# EAGLE schematic PCR_Main_ckt (EAGLE 9.6.2)

## Sheet 1 of 2
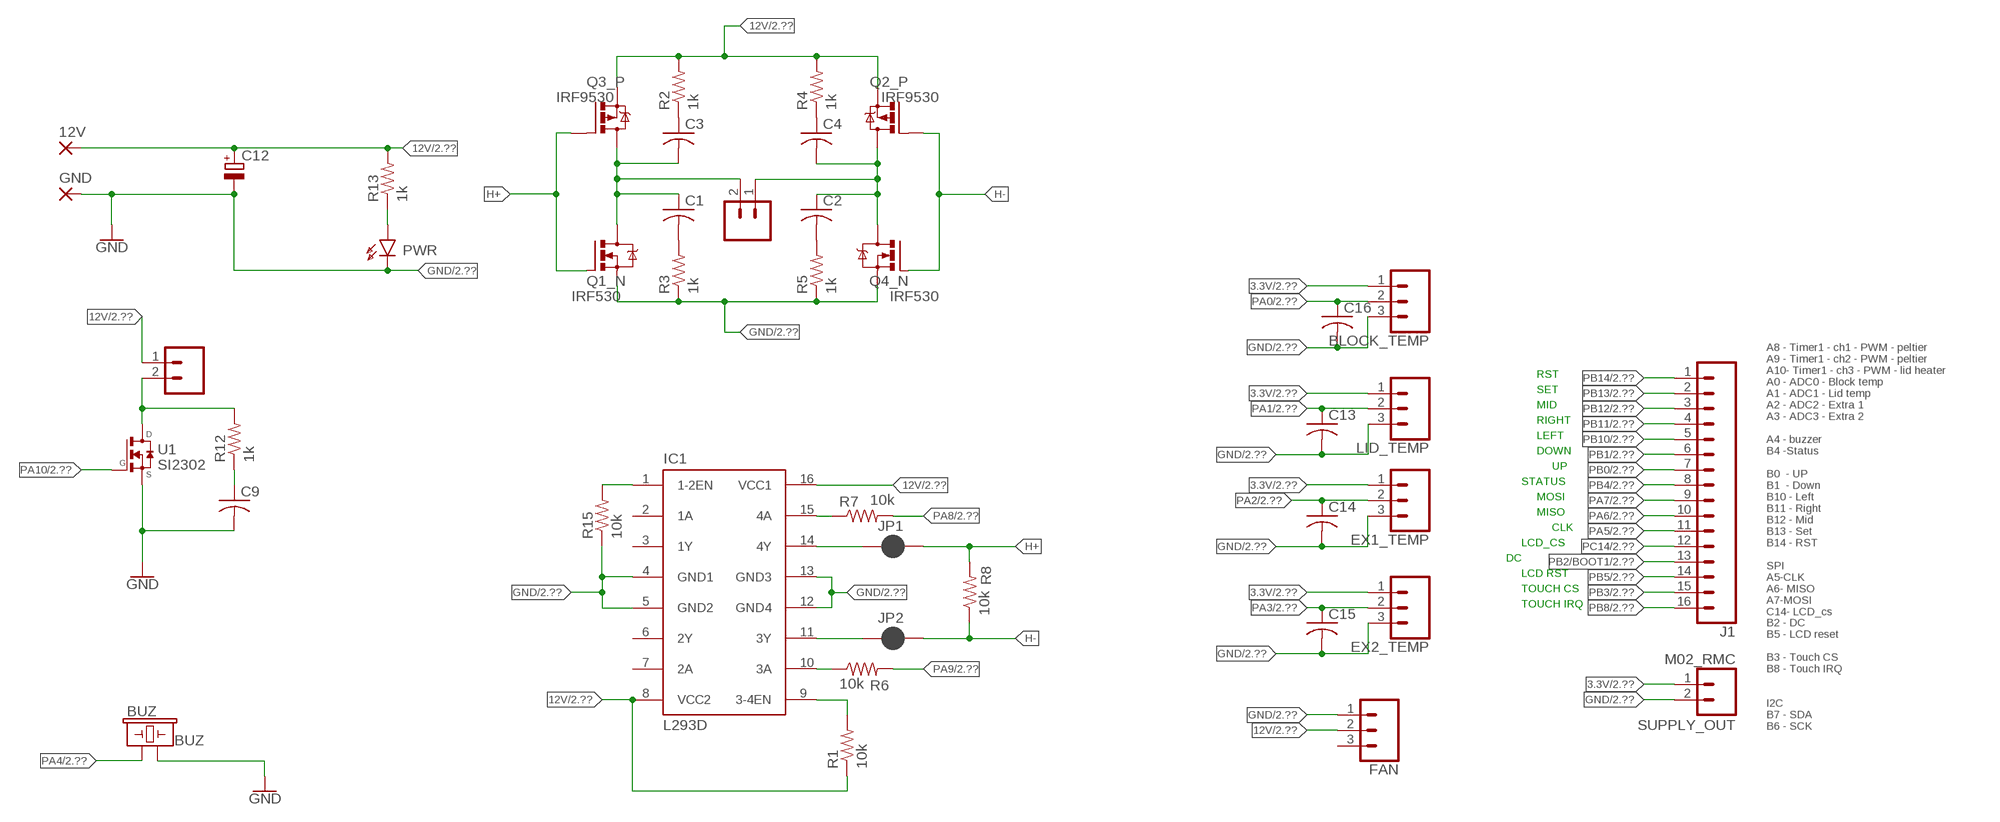
[diagram p0: schematic, sheet 1]

### Parts
12V  WIREPAD4,16O1,6  [4,16O1,6]
+PELTIER-  SCREW_TERMINAL_5.08  [SCREW_TERMINAL_5.08]
BLOCK_TEMP  CONN_03  [1X03]
BUZ  BUZ  BUZZER-PTH  [BUZZER-12MM]
C1  C-USC0805  [C0805]
C2  C-USC0805  [C0805]
C3  C-USC0805  [C0805]
C4  C-USC0805  [C0805]
C9  C-USC0805  [C0805]
C12  CPOL-EUE5-5  [E5-5]
C13  C-USC0805  [C0805]
C14  C-USC0805  [C0805]
C15  C-USC0805  [C0805]
C16  C-USC0805  [C0805]
EX1_TEMP  CONN_03  [1X03]
EX2_TEMP  CONN_03  [1X03]
FAN  CONN_03  [1X03]
GND  WIREPAD4,16O1,6  [4,16O1,6]
IC1  L293D  [DIL16]
J1  CONN_16  [1X16]
JP1  JUMPER-SMT_2_NC_PASTE_SILK  [SMT-JUMPER_2_NC_PASTE_SILK]
JP2  JUMPER-SMT_2_NC_PASTE_SILK  [SMT-JUMPER_2_NC_PASTE_SILK]
LID_HEATER  SCREW_TERMINAL_5.08  [SCREW_TERMINAL_5.08]
LID_TEMP  CONN_03  [1X03]
PWR  LED_RED_0805  [RED_LED]
Q1_N  IRF530  [TO220BV]
Q2_P  IRF9530  [TO220BV]
Q3_P  IRF9530  [TO220BV]
Q4_N  IRF530  [TO220BV]
R1  10k  R-US_R0805  [R0805]
R2  1k  R-US_R0805  [R0805]
R3  1k  R-US_R0805  [R0805]
R4  1k  R-US_R0805  [R0805]
R5  1k  R-US_R0805  [R0805]
R6  10k  R-US_R0805  [R0805]
R7  10k  R-US_R0805  [R0805]
R8  10k  R-US_R0805  [R0805]
R12  1k  R-US_R0805  [R0805]
R13  1k  R-US_R0805  [R0805]
R15  10k  R-US_R0805  [R0805]
SUPPLY_OUT  M02_RMC  [M02_RMC]
U1  SI2302  [SOT95P240X110-3N]

### Nets
3.3V: BLOCK_TEMP.1 EX1_TEMP.1 EX2_TEMP.1 LID_TEMP.1 SUPPLY_OUT.1 ; also sheet 2
12V: 12V.1(P) C12.+ FAN.2 IC1.8(VCC2) IC1.16(VCC1) LID_HEATER.1 Q2_P.S Q3_P.S R1.1 R2.2 R4.2 R13.2 ; also sheet 2
GND: BLOCK_TEMP.3 BUZ.- C9.2 C12.- C13.2 C14.2 C15.2 C16.2 EX1_TEMP.3 EX2_TEMP.3 FAN.1 GND.1(P) IC1.4(GND1) IC1.5(GND2) IC1.12(GND4) IC1.13(GND3) LID_TEMP.3 PWR.2(C) Q1_N.S Q4_N.S R3.1 R5.1 R15.1 SUPPLY_OUT.2 U1.2(S) ; also sheet 2
H+: JP1.2 Q1_N.G Q3_P.G R8.2
H-: JP2.2 Q2_P.G Q4_N.G R8.1
N$1: IC1.10(3A) R6.1
N$2: +PELTIER-.2 C1.1 C3.2 Q1_N.D Q3_P.D
N$3: +PELTIER-.1 C2.1 C4.2 Q2_P.D Q4_N.D
N$4: IC1.15(4A) R7.1
N$5: PWR.1(A) R13.1
N$6: IC1.14(4Y) JP1.1
N$7: IC1.9(3-4EN) R1.2
N$8: IC1.11(3Y) JP2.1
N$9: C1.2 R3.2
N$10: C2.2 R5.2
N$11: C3.1 R2.1
N$12: C4.1 R4.1
N$13: LID_HEATER.2 R12.2 U1.3(D)
N$20: C9.1 R12.1
N$22: IC1.1(1-2EN) R15.2
PA0: BLOCK_TEMP.2 C16.1 ; also sheet 2
PA1: C13.1 LID_TEMP.2 ; also sheet 2
PA2: C14.1 EX1_TEMP.2 ; also sheet 2
PA3: C15.1 EX2_TEMP.2 ; also sheet 2
PA4: BUZ.+ ; also sheet 2
PA5: J1.11 ; also sheet 2
PA6: J1.10 ; also sheet 2
PA7: J1.9 ; also sheet 2
PA8: R7.2 ; also sheet 2
PA9: R6.2 ; also sheet 2
PA10: U1.1(G) ; also sheet 2
PB0: J1.7 ; also sheet 2
PB1: J1.6 ; also sheet 2
PB2/BOOT1: J1.13 ; also sheet 2
PB3: J1.15 ; also sheet 2
PB4: J1.8 ; also sheet 2
PB5: J1.14 ; also sheet 2
PB8: J1.16 ; also sheet 2
PB10: J1.5 ; also sheet 2
PB11: J1.4 ; also sheet 2
PB12: J1.3 ; also sheet 2
PB13: J1.2 ; also sheet 2
PB14: J1.1 ; also sheet 2
PC14: J1.12 ; also sheet 2
Unconnected: FAN.3 IC1.2(1A) IC1.3(1Y) IC1.6(2Y) IC1.7(2A)

### Notes on the sheet
- RST
- SET
- MID
- RIGHT
- LEFT
- DOWN
- UP
- STATUS
- MOSI
- MISO
- CLK
- LCD_CS
- DC
- LCD RST
- TOUCH CS
- TOUCH IRQ
- A8 - Timer1 - ch1 - PWM - peltier
  A9 - Timer1 - ch2 - PWM - peltier
  A10- Timer1 - ch3 - PWM - lid heater
  A0 - ADC0 - Block temp
  A1 - ADC1 - Lid temp
  A2 - ADC2 - Extra 1
  A3 - ADC3 - Extra 2
  
  A4 - buzzer
  B4 -Status
  
  B0  - UP
  B1  - Down
  B10 - Left
  B11 - Right
  B12 - Mid
  B13 - Set
  B14 - RST
  
  SPI
  A5-CLK
  A6- MISO
  A7-MOSI
  C14- LCD_cs
  B2 - DC
  B5 - LCD reset
  
  B3 - Touch CS
  B8 - Touch IRQ
  
  
  I2C
  B7 - SDA
  B6 - SCK

## Sheet 2 of 2: STM32F103
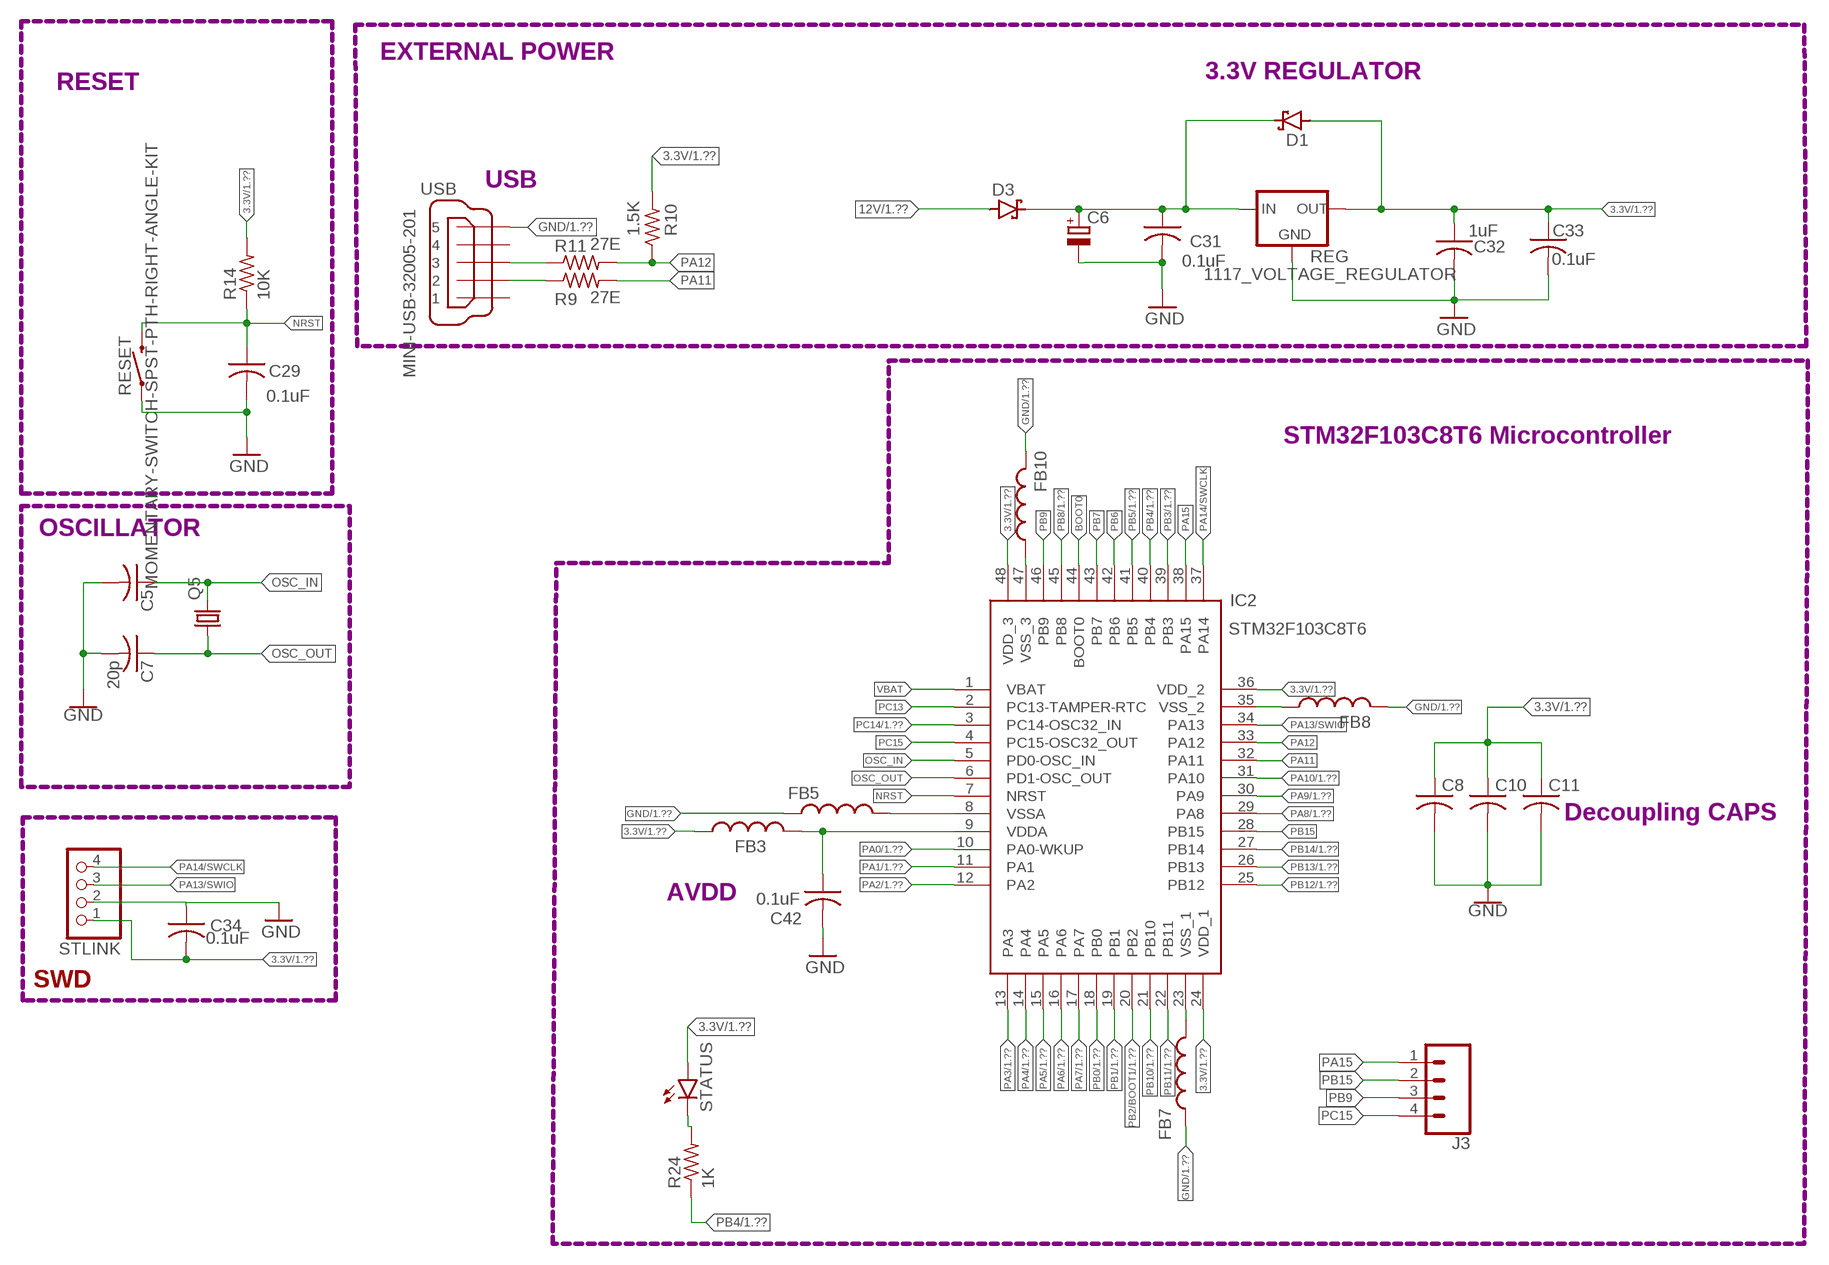
[diagram p1: schematic, sheet 2]

### Parts
C5  C-USC0805  [C0805]
C6  CPOL-EUE5-5  [E5-5]
C7  20p  C-USC0805  [C0805]
C8  C-USC0805  [C0805]
C10  C-USC0805  [C0805]
C11  C-USC0805  [C0805]
C29  0.1uF  C-USC0603  [C0603]
C31  0.1uF  C-USC0603  [C0603]
C32  1uF  C-USC0603  [C0603]
C33  0.1uF  C-USC0603  [C0603]
C34  0.1uF  C-USC0603  [C0603]
C42  0.1uF  C-USC0603  [C0603]
D1  SCHOTTKY-DIODESMD  [SMB]
D3  SCHOTTKY-DIODESMD  [SMB]
FB3  FERRITE-BEADA  [0603]
FB5  FERRITE-BEADA  [0603]
FB7  FERRITE-BEADA  [0603]
FB8  FERRITE-BEADA  [0603]
FB10  FERRITE-BEADA  [0603]
IC2  STM32F103C8T6  [QFP50P900X900X160-48N]
J3  F04_LOCKLOCK  [F04_LOCK]
Q5  CRYSTALHC49S  [HC49/S]
R9  27E  R-US_R0805  [R0805]
R10  1.5K  R-US_R0805  [R0805]
R11  27E  R-US_R0805  [R0805]
R14  10K  R-US_R0603  [R0603]
R24  1K  R-US_R0603  [R0603]
REG  1117_VOLTAGE_REGULATOR  [SOT230P700X180-4N]
RESET  MOMENTARY-SWITCH-SPST-PTH-RIGHT-ANGLE-KIT  [TACTILE_SWITCH_PTH_RIGHT_ANGLE_KIT]
STATUS  LEDCHIP-LED0603  [CHIP-LED0603]
STLINK  PINHD-1X4  [1X04]
USB  MINI-USB-32005-201  [32005-201]

### Nets
3.3V: C8.1 C10.1 C11.1 C32.1 C33.1 C34.2 D1.A FB3.1 IC2.24(VDD_1) IC2.36(VDD_2) IC2.48(VDD_3) R10.2 R14.2 REG.2(OUT) REG.4(OUT) STATUS.A STLINK.1 ; also sheet 1
12V: D3.A ; also sheet 1
BOOT0: IC2.44(BOOT0)
GND: C5.2 C6.- C7.2 C8.2 C10.2 C11.2 C29.2 C31.2 C32.2 C33.2 C34.1 C42.2 FB5.1 FB7.1 FB8.2 FB10.2 REG.1(GND) RESET.1 STLINK.2 USB.5 ; also sheet 1
N$14: R11.1 USB.3
N$15: R9.1 USB.2
N$16: C6.+ C31.1 D1.C D3.C REG.3(IN)
N$17: FB8.1 IC2.35(VSS_2)
N$18: FB7.2 IC2.23(VSS_1)
N$19: FB10.1 IC2.47(VSS_3)
N$21: FB5.2 IC2.8(VSSA)
N$25: C42.1 FB3.2 IC2.9(VDDA)
N$33: R24.2 STATUS.C
NRST: C29.1 IC2.7(NRST) R14.1 RESET.2
OSC_IN: C5.1 IC2.5(PD0-OSC_IN) Q5.2
OSC_OUT: C7.1 IC2.6(PD1-OSC_OUT) Q5.1
PA0: IC2.10(PA0-WKUP) ; also sheet 1
PA1: IC2.11(PA1) ; also sheet 1
PA2: IC2.12(PA2) ; also sheet 1
PA3: IC2.13(PA3) ; also sheet 1
PA4: IC2.14(PA4) ; also sheet 1
PA5: IC2.15(PA5) ; also sheet 1
PA6: IC2.16(PA6) ; also sheet 1
PA7: IC2.17(PA7) ; also sheet 1
PA8: IC2.29(PA8) ; also sheet 1
PA9: IC2.30(PA9) ; also sheet 1
PA10: IC2.31(PA10) ; also sheet 1
PA11: IC2.32(PA11) R9.2
PA12: IC2.33(PA12) R10.1 R11.2
PA13/SWIO: IC2.34(PA13) STLINK.3
PA14/SWCLK: IC2.37(PA14) STLINK.4
PA15: IC2.38(PA15) J3.1
PB0: IC2.18(PB0) ; also sheet 1
PB1: IC2.19(PB1) ; also sheet 1
PB2/BOOT1: IC2.20(PB2) ; also sheet 1
PB3: IC2.39(PB3) ; also sheet 1
PB4: IC2.40(PB4) R24.1 ; also sheet 1
PB5: IC2.41(PB5) ; also sheet 1
PB6: IC2.42(PB6)
PB7: IC2.43(PB7)
PB8: IC2.45(PB8) ; also sheet 1
PB9: IC2.46(PB9) J3.3
PB10: IC2.21(PB10) ; also sheet 1
PB11: IC2.22(PB11) ; also sheet 1
PB12: IC2.25(PB12) ; also sheet 1
PB13: IC2.26(PB13) ; also sheet 1
PB14: IC2.27(PB14) ; also sheet 1
PB15: IC2.28(PB15) J3.2
PC13: IC2.2(PC13-TAMPER-RTC)
PC14: IC2.3(PC14-OSC32_IN) ; also sheet 1
PC15: IC2.4(PC15-OSC32_OUT) J3.4
VBAT: IC2.1(VBAT)
Unconnected: USB.1 USB.4

### Notes on the sheet
- EXTERNAL POWER
- 3.3V REGULATOR
- RESET
- USB
- STM32F103C8T6 Microcontroller
- OSCILLATOR
- Decoupling CAPS
- AVDD
- SWD

## Library data of the parts
12V GND = wirepad:WIREPAD: Wire PAD connect wire on PCB
+PELTIER- LID_HEATER = my_3D_components:SCREW_TERMINAL_5.08
BLOCK_TEMP EX1_TEMP EX2_TEMP FAN LID_TEMP = SparkFun-Connectors:CONN_03: Multi connection point. Often used as Generic Header-pin footprint for 0.1 inch spaced/style header connections On any of the 0.1 inch spaced packages, you can populate with these: Break Away Headers - Straight <https://www.sparkfun.com/products/116> (PRT-00116) Break Away Male Headers - Right Angle <https://www.sparkfun.com/products/553> (PRT-00553) Female Headers <https://www.sparkfun.com/products/115> (PRT-00115) Break Away Headers - Machine Pin <https://www.sparkfun.com/products/117> (PRT-00117) Break Away Female Headers - Swiss Machine Pin <https://www.sparkfun.com/products/743> (PRT-00743) Stackable Header - 3 Pin (Female, 0.1") <https://www.sparkfun.com/products/13875> (PRT-13875) For SCREWTERMINALS and SPRING TERMINALS visit here: Screw Terimnals on SparkFun.com <https://www.sparkfun.com/search/results?term=Screw+Terminals> (5mm/3.5mm/2.54mm spacing) This device is also useful as a general connection point to wire up your design to another part of your project. Our various solder wires solder well into these plated through hole pads. Hook-Up Wire - Assortment (Stranded, 22 AWG) <https://www.sparkfun.com/products/11375> (PRT-11375) Hook-Up Wire - Assortment (Solid Core, 22 AWG) <https://www.sparkfun.com/products/11367> (PRT-11367) View the entire wire category on our website here <https://www.sparkfun.com/categories/141> Special notes: Molex polarized connector foot print use with SKU : PRT-08232 with associated crimp pins and housings.
BUZ = SparkFun-Electromechanical:BUZZER: Buzzer Small round buzzers that operate around the audible 2kHz range. You can use these as speakers to create simple music or user interfaces. Variant Overview: PTH - Mini Speaker - PC Mount 12mm 2.048kHz <https://www.sparkfun.com/products/7950> PTH_KIT - Mini Speaker - PC Mount 12mm 2.048kHz <https://www.sparkfun.com/products/7950> KIT simplifies soldering by adding stop mask to one side of the pads. PTH_NO_SILK - Mini Speaker - PC Mount 12mm 2.048kHz <https://www.sparkfun.com/products/7950> No silkscreen indicator of buzzer outline. PTH_KIT_NO_SILK - Mini Speaker - PC Mount 12mm 2.048kHz <https://www.sparkfun.com/products/7950> KIT package w/o silkscreen SMD - Buzzer Audio Magnetic (CCV-084B16) SMD buzzer used on, e.g. the LilyPad Buzzer <https://www.sparkfun.com/products/8463> and RFID USB Reader <https://www.sparkfun.com/products/9963>. SMD_KIT - Buzzer Audio Magnetic (CCV-084B16) SMD Buzzer with elongated pins to make soldering easier. Used on the SparkFun Simon Says - Surface Mount Soldering Kit <https://www.sparkfun.com/products/10935>.; PROD_ID: COMP-08253; SF_SKU: COM-07950
C1-C5 C7-C11 C13-C16 = my_3D_components:C-US: CAPACITOR, American symbol
C6 C12 = rcl:CPOL-EU: POLARIZED CAPACITOR, European symbol; SPICEPREFIX: C
C29 C31 C33 C34 C42 = rcl:C-US: CAPACITOR, American symbol; SPICEPREFIX: C
C32 = my_3D_components:C-US: CAPACITOR, American symbol; SPICEPREFIX: C
D1 D3 = diode:SCHOTTKY-DIODE: Schottky Diode
FB3 FB5 FB7 FB8 FB10 = m-pad-2.1:FERRITE-BEAD: Ferrite beads in various packages
IC1 = st-microelectronics:L293D: PUSH-PULL 4 CHANNEL DRIVER; MPN: L293D; OC_FARNELL: 9589619; OC_NEWARK: 56P8249
IC2 = SamacSys_Parts:STM32F103C8T6: Mainstream Performance line, ARM Cortex-M3 MCU with 64 Kbytes Flash, 72 MHz CPU, motor control, USB and CAN Source: Datasheet <https://www.st.com/resource/en/datasheet/stm32f103c8.pdf>; ARROW_PART_NUMBER: STM32F103C8T6; ARROW_PRICE-STOCK: https://www.arrow.com/en/products/stm32f103c8t6/stmicroelectronics; DESCRIPTION: Mainstream Performance line, ARM Cortex-M3 MCU with 64 Kbytes Flash, 72 MHz CPU, motor control, USB and CAN; HEIGHT: 1.6mm; MANUFACTURER_NAME: STMicroelectronics; MANUFACTURER_PART_NUMBER: stm32f103c8t6; MOUSER_PART_NUMBER: 511-STM32F103C8T6; MOUSER_PRICE-STOCK: https://www.mouser.co.uk/ProductDetail/STMicroelectronics/STM32F103C8T6?qs=bhCVus9SdFtq6kqxsU5%2FDA%3D%3D
J1 = SparkFun-Connectors:CONN_16: Multi connection point. Often used as Generic Header-pin footprint for 0.1 inch spaced/style header connections On any of the 0.1 inch spaced packages, you can populate with these: Break Away Headers - Straight <https://www.sparkfun.com/products/116> (PRT-00116) Break Away Male Headers - Right Angle <https://www.sparkfun.com/products/553> (PRT-00553) Female Headers <https://www.sparkfun.com/products/115> (PRT-00115) Break Away Headers - Machine Pin <https://www.sparkfun.com/products/117> (PRT-00117) Break Away Female Headers - Swiss Machine Pin <https://www.sparkfun.com/products/743> (PRT-00743) For SCREWTERMINALS and SPRING TERMINALS visit here: Screw Terimnals on SparkFun.com <https://www.sparkfun.com/search/results?term=Screw+Terminals> (5mm/3.5mm/2.54mm spacing) This device is also useful as a general connection point to wire up your design to another part of your project. Our various solder wires solder well into these plated through hole pads. Hook-Up Wire - Assortment (Stranded, 22 AWG) <https://www.sparkfun.com/products/11375> (PRT-11375) Hook-Up Wire - Assortment (Solid Core, 22 AWG) <https://www.sparkfun.com/products/11367> (PRT-11367) View the entire wire category on our website here <https://www.sparkfun.com/categories/141> Special notes: Molex polarized connector foot print use with SKU : PRT-08231 with associated crimp pins and housings. 1MM SMD Version SKU: PRT-10208 NOTES ON THE VARIANTS LOCK and LOCK_LONGPADS... This footprint was designed to help hold the alignment of a through-hole component (i.e. 6-pin header) while soldering it into place. You may notice that each hole has been shifted either up or down by 0.005 of an inch from it's more standard position (which is a perfectly straight line). This slight alteration caused the pins (the squares in the middle) to touch the edges of the holes. Because they are alternating, it causes a "brace" to hold the component in place. 0.005 has proven to be the perfect amount of "off-center" position when using our standard breakaway headers. Although looks a little odd when you look at the bare footprint, once you have a header in there, the alteration is very hard to notice. Also,if you push a header all the way into place, it is covered up entirely on the bottom side.
J3 = my_3D_components:F04_LOCK: Multi connection point. Often used as Generic Header-pin footprint for 0.1 inch spaced/style header connections On any of the 0.1 inch spaced packages, you can populate with these: Break Away Headers - Straight <https://www.sparkfun.com/products/116> (PRT-00116) Break Away Male Headers - Right Angle <https://www.sparkfun.com/products/553> (PRT-00553) Female Headers <https://www.sparkfun.com/products/115> (PRT-00115) Break Away Headers - Machine Pin <https://www.sparkfun.com/products/117> (PRT-00117) Break Away Female Headers - Swiss Machine Pin <https://www.sparkfun.com/products/743> (PRT-00743) For SCREWTERMINALS and SPRING TERMINALS visit here: Screw Terimnals on SparkFun.com <https://www.sparkfun.com/search/results?term=Screw+Terminals> (5mm/3.5mm/2.54mm spacing) This device is also useful as a general connection point to wire up your design to another part of your project. Our various solder wires solder well into these plated through hole pads. Hook-Up Wire - Assortment (Stranded, 22 AWG) <https://www.sparkfun.com/products/11375> (PRT-11375) Hook-Up Wire - Assortment (Solid Core, 22 AWG) <https://www.sparkfun.com/products/11367> (PRT-11367) View the entire wire category on our website here <https://www.sparkfun.com/categories/141> Special notes: Molex polarized connector foot print use with SKU : PRT-08231 with associated crimp pins and housings. 1MM SMD Version SKU: PRT-10208; PROD_ID: CONN-09696
JP1 JP2 = SparkFun-Jumpers:JUMPER-SMT_2_NC_PASTE: Normally closed solder jumper This jumper has an aperture in the stencil to allow solder paste to bridge the split in the wire so it's normally closed (NC). Wick off the solder to open the connection. Reapply solder to reclose the connection.
PWR = my_3D_components:LED_
Q1_N Q4_N = transistor-power:IRF530: HEXFET Power MOSFET
Q2_P Q3_P = transistor-power:IRF9530: P-CHANNEL HEXFET POWER-MOS-FET Source: http://www.irf.com/product-info/datasheets/data/irf9530.pdf
Q5 = crystal:CRYSTAL: CRYSTAL; OC_FARNELL: 1667008; OC_NEWARK: unknown
R1-R13 R15 = my_3D_components:R-US_: RESISTOR, American symbol; SPICEPREFIX: R
R14 R24 = rcl:R-US_: RESISTOR, American symbol; SPICEPREFIX: R
REG = my_3D_components:1117_VOLTAGE_REGULATOR
RESET = SparkFun-Switches:MOMENTARY-SWITCH-SPST: Momentary Switch (Pushbutton) - SPST Normally-open (NO) SPST momentary switches (buttons, pushbuttons). Variants PTH-12MM - 12mm square, through-hole Momentary Pushbutton Switch - 12mm Square <https://www.sparkfun.com/products/9190> (COM-09190) PTH-6.0MM, PTH-6.0MM-KIT - 6.0mm square, through-hole Mini Pushbutton Switch <https://www.sparkfun.com/products/97> (COM-00097) KIT package intended for soldering kit's - only one side of pads' copper is exposed. PTH-RIGHT-ANGLE-KIT - Right-angle, through-hole Right Angle Tactile Button <https://www.sparkfun.com/products/10791> - Used on SparkFun BigTime Watch Kit <https://www.sparkfun.com/products/11734> SMD-12MM - 12mm square, surface-mount Tactile Button - SMD (12mm) <https://www.sparkfun.com/products/12993> (COM-12993) Used on SparkFun PicoBoard <https://www.sparkfun.com/products/11888> SMD-4.5MM - 4.5mm Square Trackball Switch Used on SparkFun Blackberry Trackballer Breakout <https://www.sparkfun.com/products/13169> SMD-4.6MMX2.8MM - 4.60mm x 2.80mm, surface mount Used on SparkFun SAMD21 Mini Breakout <https://www.sparkfun.com/products/13664> SMD-5.2MM, SMD-5.2-REDUNDANT - 5.2mm square, surface-mount Mini Pushbutton Switch - SMD <https://www.sparkfun.com/products/8720> (COM-08720) Used on Arduino Pro Mini <https://www.sparkfun.com/products/11114> REDUNDANT package connects both switch circuits together SMD-6.0X3.5MM - 6.0 x 3.5mm, surface mount Momentary Reset Switch SMD <https://www.sparkfun.com/products/8229> (COM-08229) SMD-6.2MM-TALL - 6.2mm square, surface mount Tactile Button - SMD (6mm) <https://www.sparkfun.com/products/12992> Used on SparkFun Digital Sandbox <https://www.sparkfun.com/products/12651> SMD-RIGHT-ANGLE - Right-angle, surface mount Used on SparkFun Block for Intel® Edison - Arduino <https://www.sparkfun.com/products/13036>; PROD_ID: CONN-10672; SF_SKU: COM-10791
STATUS = led:LED: LED OSRAM: - CHIPLED LG R971, LG N971, LY N971, LG Q971, LY Q971, LO R971, LY R971 LH N974, LH R974 LS Q976, LO Q976, LY Q976 LO Q996 - Hyper CHIPLED LW Q18S LB Q993, LB Q99A, LB R99A - SideLED LS A670, LO A670, LY A670, LG A670, LP A670 LB A673, LV A673, LT A673, LW A673 LH A674 LY A675 LS A676, LA A676, LO A676, LY A676, LW A676 LS A679, LY A679, LG A679 - Hyper Micro SIDELED® LS Y876, LA Y876, LO Y876, LY Y876 LT Y87S - SmartLED LW L88C, LW L88S LB L89C, LB L89S, LG L890 LS L89K, LO L89K, LY L89K LS L896, LA L896, LO L896, LY L896 - TOPLED LS T670, LO T670, LY T670, LG T670, LP T670 LSG T670, LSP T670, LSY T670, LOP T670, LYG T670 LG T671, LOG T671, LSG T671 LB T673, LV T673, LT T673, LW T673 LH T674 LS T676, LA T676, LO T676, LY T676, LB T676, LH T676, LSB T676, LW T676 LB T67C, LV T67C, LT T67C, LS T67K, LO T67K, LY T67K, LW E67C LS E67B, LA E67B, LO E67B, LY E67B, LB E67C, LV E67C, LT E67C LW T67C LS T679, LY T679, LG T679 LS T770, LO T770, LY T770, LG T770, LP T770 LB T773, LV T773, LT T773, LW T773 LH T774 LS E675, LA E675, LY E675, LS T675 LS T776, LA T776, LO T776, LY T776, LB T776 LHGB T686 LT T68C, LB T68C - Hyper Mini TOPLED® LB M676 - Mini TOPLED Santana® LG M470 LS M47K, LO M47K, LY M47K Source: http://www.osram.convergy.de LUXEON: - LUMILED® LXK2-PW12-R00, LXK2-PW12-S00, LXK2-PW14-U00, LXK2-PW14-V00 LXK2-PM12-R00, LXK2-PM12-S00, LXK2-PM14-U00 LXK2-PE12-Q00, LXK2-PE12-R00, LXK2-PE12-S00, LXK2-PE14-T00, LXK2-PE14-U00 LXK2-PB12-K00, LXK2-PB12-L00, LXK2-PB12-M00, LXK2-PB14-N00, LXK2-PB14-P00, LXK2-PB14-Q00 LXK2-PR12-L00, LXK2-PR12-M00, LXK2-PR14-Q00, LXK2-PR14-R00 LXK2-PD12-Q00, LXK2-PD12-R00, LXK2-PD12-S00 LXK2-PH12-R00, LXK2-PH12-S00 LXK2-PL12-P00, LXK2-PL12-Q00, LXK2-PL12-R00 Source: www.luxeon.com KINGBRIGHT: KA-3528ASYC Source: www.kingbright.com
STLINK = pinhead:PINHD-1X4: PIN HEADER
SUPPLY_OUT = my_3D_components:M02_RMC
U1 = my_3D_components:SI2302
USB = con-cypressindustries:MINI-USB-: MINI USB-B Conector Source: www.cypressindustries.com; OC_FARNELL: unknown; OC_NEWARK: unknown